# EAGLE schematic suppport_adum1400 (EAGLE 6.4)
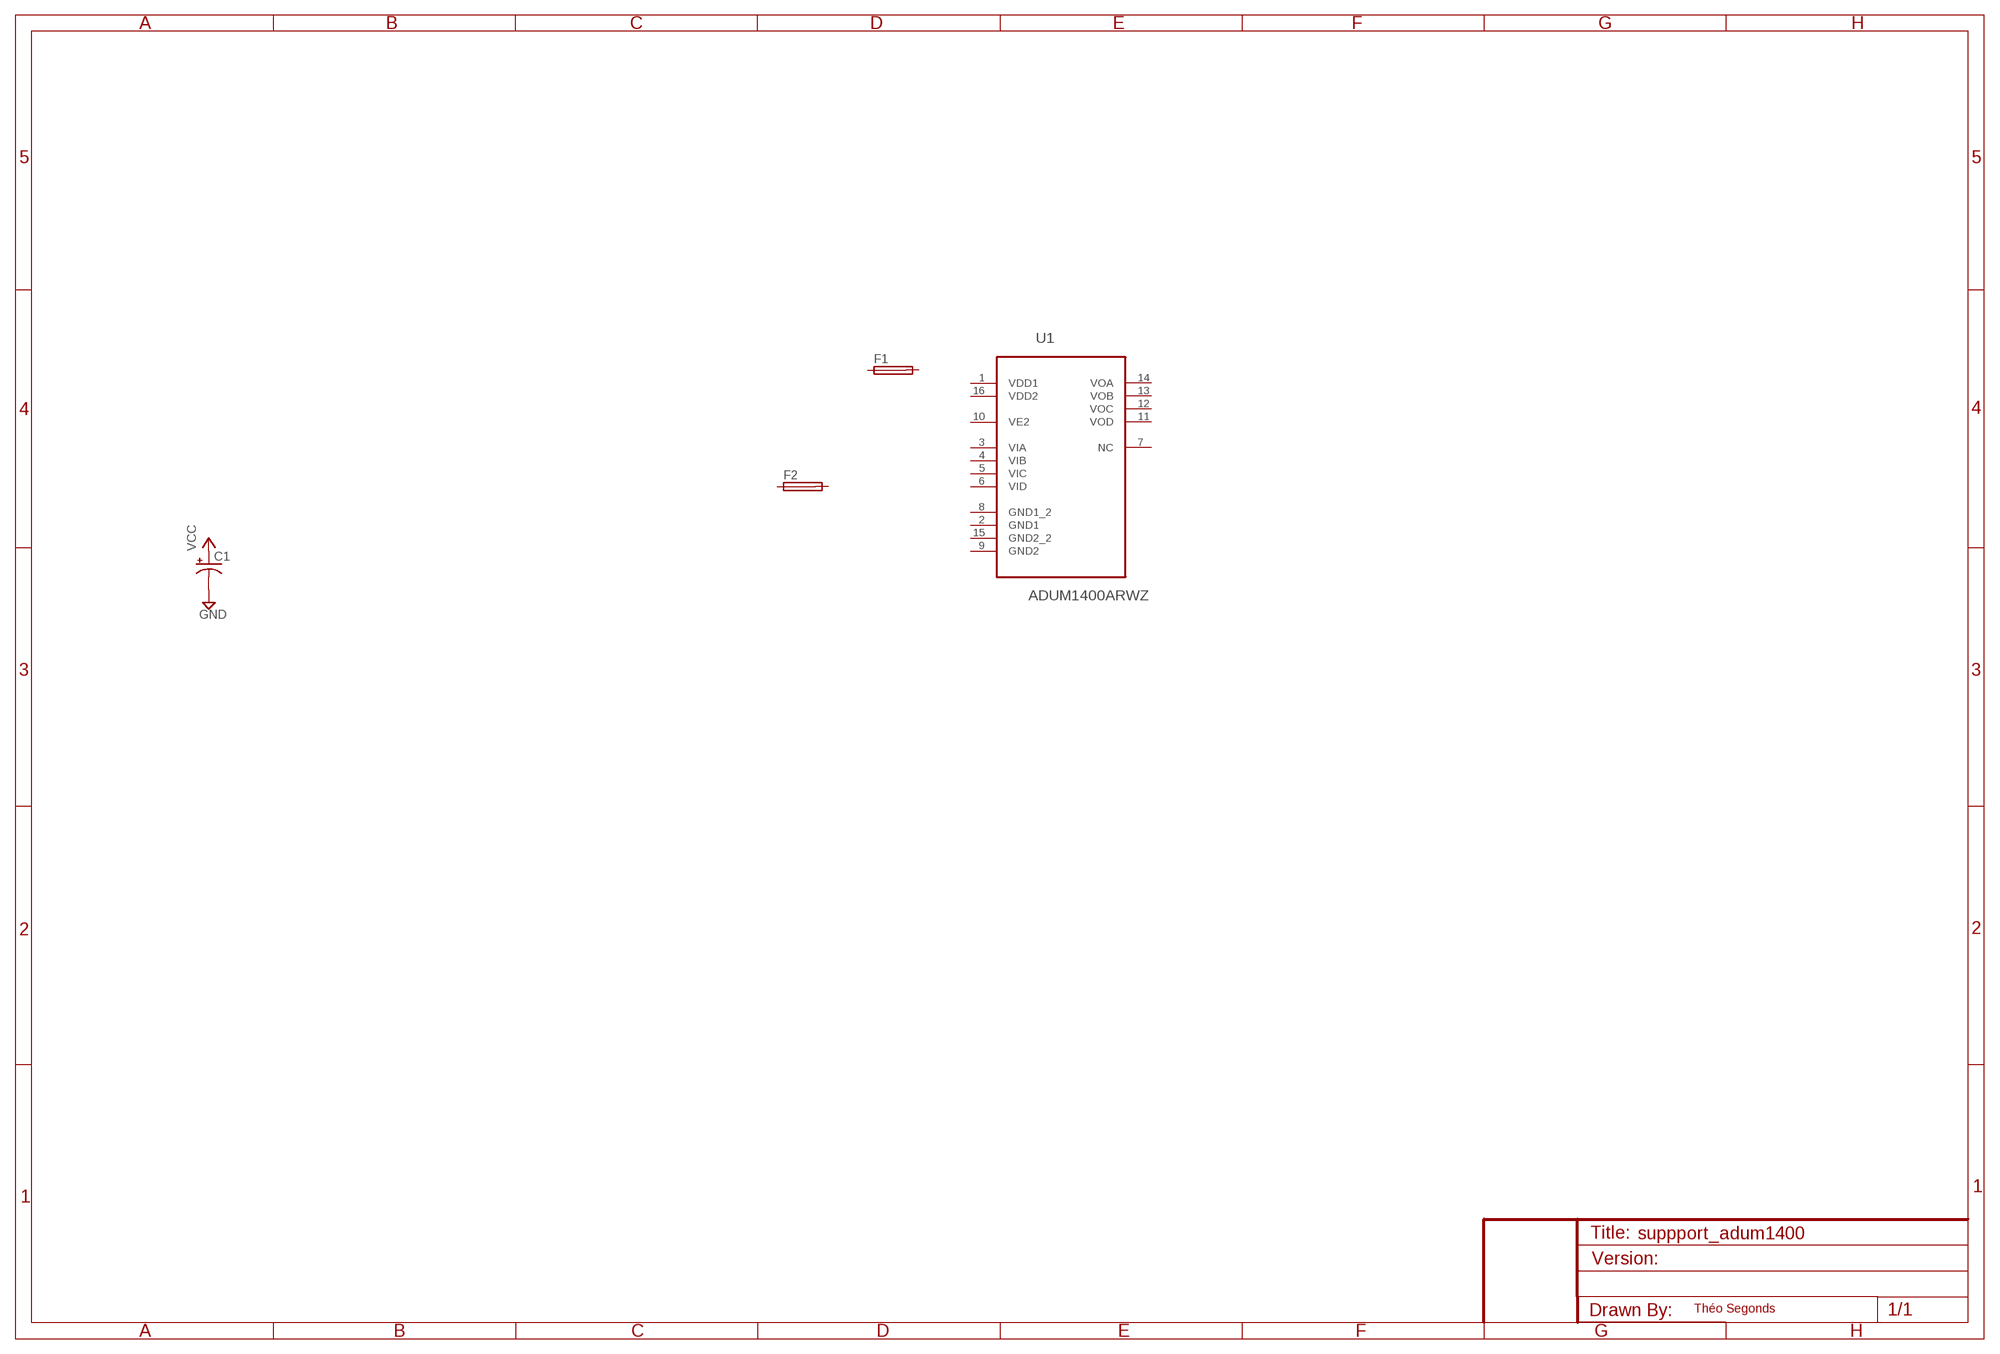
[diagram p0: schematic, sheet 1]

## Parts
C1  CAP_POLPTH1  [CPOL-RADIAL-100UF-25V]
F1  SH22,5A  [SH22,5A]
F2  SH22,5A  [SH22,5A]
U1  ADUM1400ARWZ  [SOIC127P1032X265-16N]

## Nets
GND: C1.2(-)
VCC: C1.1(+)
Unconnected: F1.1 F1.2 F2.1 F2.2 U1.2(GND1) U1.3(VIA) U1.4(VIB) U1.5(VIC) U1.6(VID) U1.7(NC) U1.8(GND1_2) U1.9(GND2) U1.10(VE2) U1.11(VOD) U1.12(VOC) U1.13(VOB) U1.14(VOA) U1.15(GND2_2)

## Notes on the sheet
- Théo Segonds

## Power pins joined to a net without a drawn wire
VDD1: U1.1(VDD1)
VDD2: U1.16(VDD2)

## Library data of the parts
C1 = SparkFun-Passives:CAP_POL: Capacitor Polarized These are standard SMD and PTH capacitors. Normally 10uF, 47uF, and 100uF in electrolytic and tantalum varieties. Always verify the external diameter of the through hole cap, it varies with capacity, voltage, and manufacturer. The EIA devices should be standard.
F1 F2 = fuse:SH22,5A: FUSE HOLDER grid 22,5mm, isolated cap OGN0031 8201, Schurter (Buerklin); MPN: 0031.7701.11; OC_FARNELL: unknown; OC_NEWARK: 04F1224
U1 = Analog Devices_By_element14_Batch_1:ADUM1400ARWZ: Quad-Channel Digital Isolators; MPN: ADUM1400ARWZ; OC_FARNELL: 1226217; OC_NEWARK: 19M8755; PACKAGE: SOIC-16; SUPPLIER: Analog Devices

## Net classes
1 +5V: width 0.6 mm, drill 0.2 mm, clearance 0.4 mm